# EAGLE design maze_hub_1_1 (EAGLE 6.6.0)
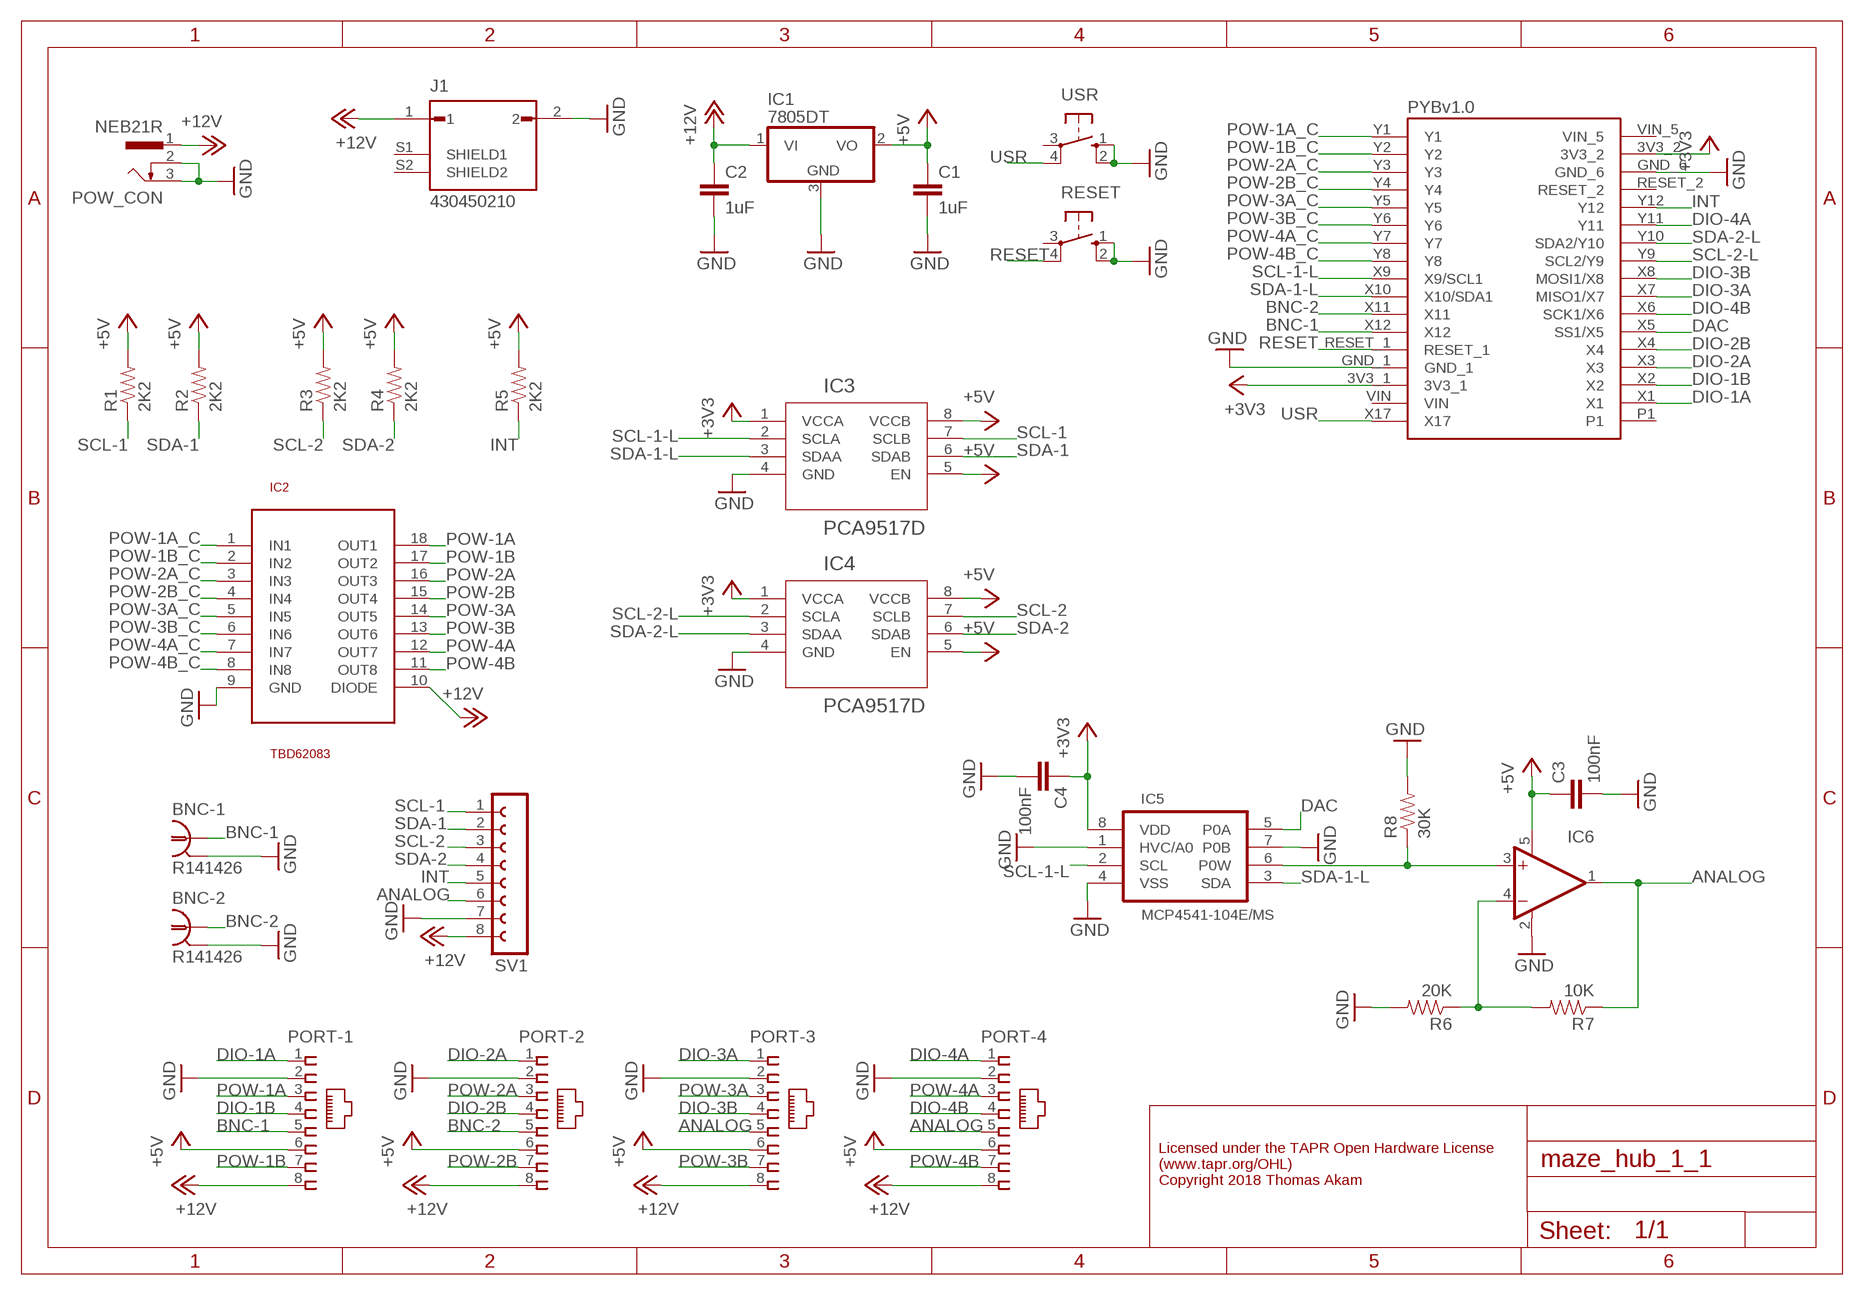
[diagram p0: schematic, sheet 1]

## Parts
BNC-1  R141426  [R141426]
BNC-2  R141426  [R141426]
C1  1uF  C-EUC1206  [C1206]
C2  1uF  C-EUC1206  [C1206]
C3  100nF  C-EUC0805  [C0805]
C4  100nF  C-EUC0805  [C0805]
IC1  7805DT  [TO252]
IC2  TBD62083  ULN2803  [SO18L]
IC3  PCA9517D  [D8]
IC4  PCA9517D  [D8]
IC5  MCP4541-104E/MS  [SOP65P490X110-8N]
IC6  OPA197  [SOT23-5]
J1  430450210  [MOLEX_430450210]
PORT-1  RJ45VERTICAL  [RJ45-NO-SHIELD-VERTICAL]
PORT-2  RJ45VERTICAL  [RJ45-NO-SHIELD-VERTICAL]
PORT-3  RJ45VERTICAL  [RJ45-NO-SHIELD-VERTICAL]
PORT-4  RJ45VERTICAL  [RJ45-NO-SHIELD-VERTICAL]
POW_CON  NEB21R  [NEB21R]
R1  2K2  0.3OHM-1/8W-1%(0805)  [0805]
R2  2K2  0.3OHM-1/8W-1%(0805)  [0805]
R3  2K2  0.3OHM-1/8W-1%(0805)  [0805]
R4  2K2  0.3OHM-1/8W-1%(0805)  [0805]
R5  2K2  0.3OHM-1/8W-1%(0805)  [0805]
R6  20K  0.3OHM-1/8W-1%(0805)  [0805]
R7  10K  0.3OHM-1/8W-1%(0805)  [0805]
R8  30K  0.3OHM-1/8W-1%(0805)  [0805]
RESET  40-XX  [B3F-40XX]
SV1  FE08W  [FE08W]
U$1  PYBOARD-REDUCED  [PYBOARD-REDUCED]
USR  40-XX  [B3F-40XX]

## Nets
+3V3: C4.1 IC3.1(VCCA) IC4.1(VCCA) IC5.8(VDD) U$1.3V3_1 U$1.3V3_2
+5V: C1.1 C3.1 IC1.2(VO) IC3.5(EN) IC3.8(VCCB) IC4.5(EN) IC4.8(VCCB) IC6.5(V+) PORT-1.6 PORT-2.6 PORT-3.6 PORT-4.6 R1.2 R2.2 R3.2 R4.2 R5.2
+12V: C2.1 IC1.1(VI) IC2.10(DIODE) J1.1 PORT-1.8 PORT-2.8 PORT-3.8 PORT-4.8 POW_CON.1 SV1.8
ANALOG: IC6.1(OUT) PORT-3.5 PORT-4.5 R7.1 SV1.6
BNC-1: BNC-1.1 PORT-1.5 U$1.X12
BNC-2: BNC-2.1 PORT-2.5 U$1.X11
DAC: IC5.5(P0A) U$1.X5(SS1/X5)
DIO-1A: PORT-1.1 U$1.X1
DIO-1B: PORT-1.4 U$1.X2
DIO-2A: PORT-2.1 U$1.X3
DIO-2B: PORT-2.4 U$1.X4
DIO-3A: PORT-3.1 U$1.X7(MISO1/X7)
DIO-3B: PORT-3.4 U$1.X8(MOSI1/X8)
DIO-4A: PORT-4.1 U$1.Y11
DIO-4B: PORT-4.4 U$1.X6(SCK1/X6)
GND: BNC-1.2(GND) BNC-2.2(GND) C1.2 C2.2 C3.2 C4.2 IC1.3(GND) IC2.9(GND) IC3.4(GND) IC4.4(GND) IC5.1(HVC/A0) IC5.4(VSS) IC5.7(P0B) IC6.2(V-) J1.2 PORT-1.2 PORT-2.2 PORT-3.2 PORT-4.2 POW_CON.2 POW_CON.3 R6.2 R8.2 RESET.1(S) RESET.2(S1) SV1.7 U$1.GND_1 U$1.GND_6 USR.1(S) USR.2(S1)
INT: R5.1 SV1.5 U$1.Y12
N$6: IC6.4(-IN) R6.1 R7.2
POW-1A: IC2.18(OUT1) PORT-1.3
POW-1A_C: IC2.1(IN1) U$1.Y1
POW-1B: IC2.17(OUT2) PORT-1.7
POW-1B_C: IC2.2(IN2) U$1.Y2
POW-2A: IC2.16(OUT3) PORT-2.3
POW-2A_C: IC2.3(IN3) U$1.Y3
POW-2B: IC2.15(OUT4) PORT-2.7
POW-2B_C: IC2.4(IN4) U$1.Y4
POW-3A: IC2.14(OUT5) PORT-3.3
POW-3A_C: IC2.5(IN5) U$1.Y5
POW-3B: IC2.13(OUT6) PORT-3.7
POW-3B_C: IC2.6(IN6) U$1.Y6
POW-4A: IC2.12(OUT7) PORT-4.3
POW-4A_C: IC2.7(IN7) U$1.Y7
POW-4B: IC2.11(OUT8) PORT-4.7
POW-4B_C: IC2.8(IN8) U$1.Y8
RESET: RESET.4(P1) U$1.RESET_1
SCL-1: IC3.7(SCLB) R1.1 SV1.1
SCL-1-L: IC3.2(SCLA) IC5.2(SCL) U$1.X9(X9/SCL1)
SCL-2: IC4.7(SCLB) R3.1 SV1.3
SCL-2-L: IC4.2(SCLA) U$1.Y9(SCL2/Y9)
SDA-1: IC3.6(SDAB) R2.1 SV1.2
SDA-1-L: IC3.3(SDAA) IC5.3(SDA) U$1.X10(X10/SDA1)
SDA-2: IC4.6(SDAB) R4.1 SV1.4
SDA-2-L: IC4.3(SDAA) U$1.Y10(SDA2/Y10)
SIG3: IC5.6(P0W) IC6.3(+IN) R8.1
USR: U$1.X17 USR.4(P1)
Unconnected: J1.S1(SHIELD1) J1.S2(SHIELD2) RESET.3(P) U$1.P1 U$1.RESET_2 U$1.VIN U$1.VIN_5 USR.3(P)

## Notes on the sheet
- Licensed under the TAPR Open Hardware License
  (www.tapr.org/OHL)
  Copyright 2018 Thomas Akam

## Power pins joined to a net without a drawn wire
GND: BNC-1.3(GND) BNC-1.4(GND) BNC-1.5(GND) BNC-2.3(GND) BNC-2.4(GND) BNC-2.5(GND)

## Library data of the parts
BNC-1 BNC-2 = con-coax:R141426: BNC COAX CONNECTOR Radiall 50/75 Ohm Spoerle; MF: FARNELL; MPN: R141426161; OC_FARNELL: 4195115; OC_NEWARK: 14J7919
C1 C2 = resistor:C-EU: CAPACITOR, European symbol
C3 C4 = rcl:C-EU: CAPACITOR, European symbol
IC1 = linear:78*: Positive VOLTAGE REGULATOR Source: http://cache.national.com/ds/LM/LM78L05.pdf http://www.fairchildsemi.com/ds/LM/LM7805.pdf
IC2 = uln2803:ULN2803
IC3 IC4 = ultra_librarian:PCA9517D; BUILT_BY: EMA_UL_Team; MANUFACTURER_PART_NUMBER: PCA9517D; VENDOR: Texas Instruments
IC5 = Digital_potentiometers:MCP4541-104E/MS
IC6 = burr-brown:OPA197
J1 = Molex_430450210:430450210: Check availability <https://pricing.snapeda.com/parts/43045-0210/Molex/view-part?ref=eda>; AVAILABILITY: In Stock; CHECK_PRICES: https://www.snapeda.com/parts/43045-0210/Molex/view-part/?ref=eda; DESCRIPTION: Microfit 3.0 RA SMT/Nail DR 15Au 2 Ckt | Molex Incorporated 43045-0210; MF: Molex; MP: 43045-0210; PACKAGE: None; PRICE: None; SNAPEDA_LINK: https://www.snapeda.com/parts/43045-0210/Molex/view-part/?ref=snap
PORT-1-PORT-4 = con-tycoelectronics-vertical_RJ45:RJ45: CORCOM Modular RJ Jacks No Shield Source: www.tycoelectronics.com .. ENG_DS_1654001_1099_RJ_L_0507.pdf
POW_CON = con-lumberg:NEB21R: Netzgeräte-Einbaukupplung abgewinkelte Ausführung mit Öffner Source: http://www.lumberg.com/Produkte/PDFs/NEB21R.pdf; MPN: NEB 21 R; OC_FARNELL: 1217037; OC_NEWARK: 97K6458
R1-R8 = SparkFun-Resistors:0.3OHM-1/8W-1%(0805): RES-11622; PROD_ID: RES-11622; VALUE: 0.3
RESET USR = switch-omron:40-XX: OMRON SWITCH; MF: OMRON COMPONENTS USA; MPN: B3F-4000; OC_FARNELL: 176434; OC_NEWARK: 36K3105
SV1 = con-lsta:FE08W: FEMALE HEADER; OC_FARNELL: unknown; OC_NEWARK: unknown
U$1 = micropython:PYBOARD-REDUCED

## Board
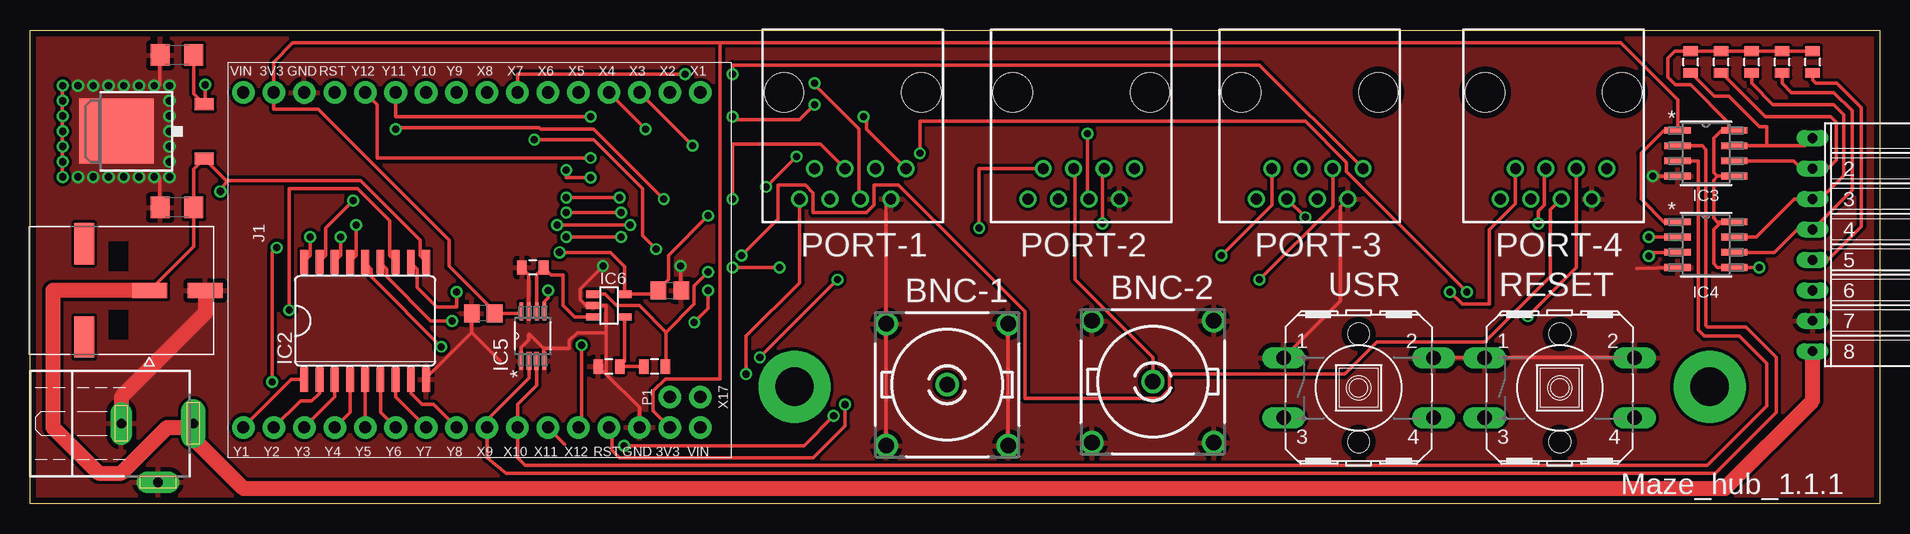
[diagram p1: board, top side]
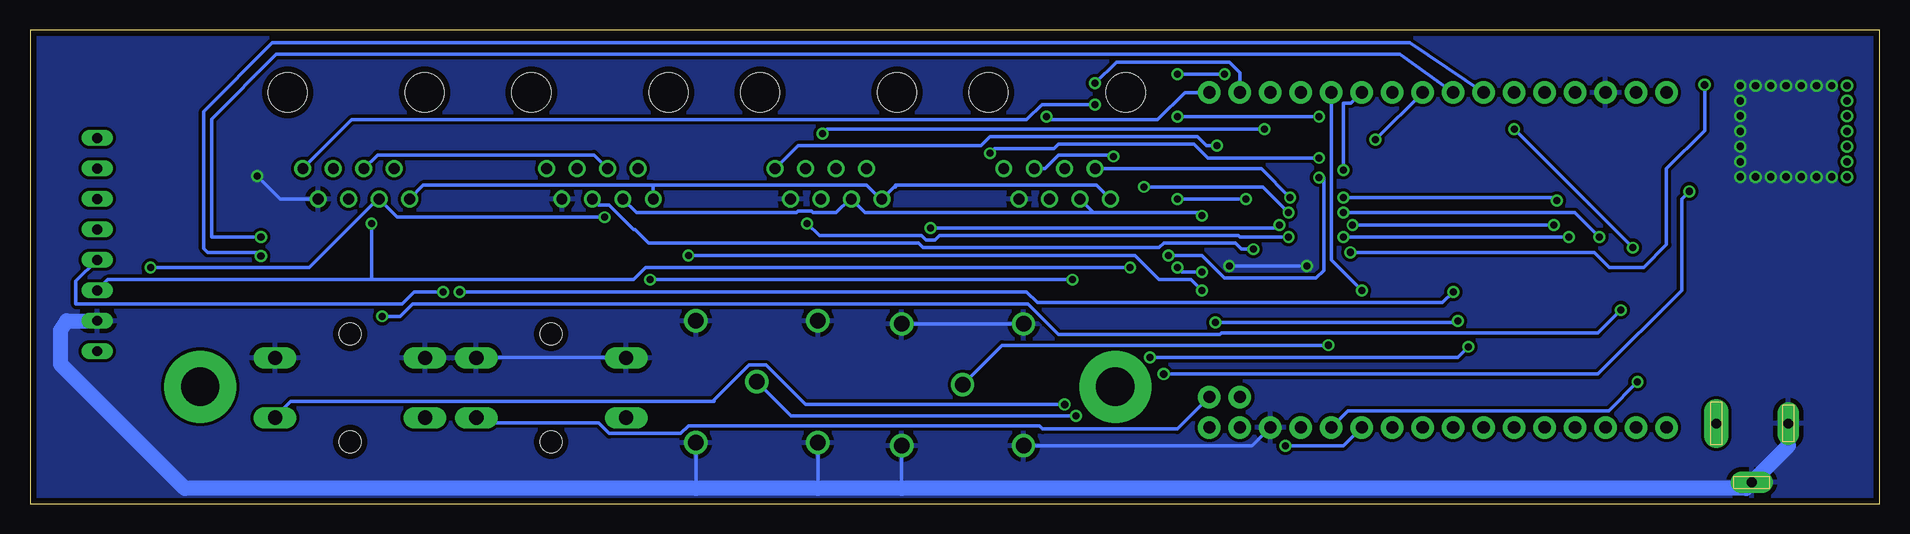
[diagram p2: board, bottom side, seen from below]

Size 154.19 x 39.5 mm. Coordinates in mm from the lower left corner, seen from the top.
Outline: 0,0 0,39.5 154.19,39.5 154.19,0 0,0
Copper layers (1*16): Top 0.035mm / dielectric 1.5mm / Bottom 0.035mm
Design rules "default *": minimum track width 12mil, minimum drill 23mil, track to track 10mil, track to pad 10mil, pad to pad 10mil, via to via 10mil, smd to smd 10mil, copper to edge 20mil, drill to drill 8mil, minimum pad ring 10mil, minimum via ring 8mil, stop-mask expansion 4mil, vias tented up to drill 0mil, thermal gap 15mil
vRestrict: area 22.1,11.7 to 33.8,19.1; area 46.5,10.7 to 54.9,19.3; area 64,20.1 to 74.9,23.1; area 72.6,16 to 81,18.8; area 82.5,20.3 to 94,22.9; area 90.2,16.5 to 99.1,19.1; area 101.6,20.3 to 113,22.9; area 108,16.5 to 114.3,20.3; area 121.9,16.5 to 133.3,22.9; area 135.9,16.5 to 143.5,31.8; area 69.6,3 to 84.1,16.8; area 86.9,3 to 100.6,16.5

### Footprints (pad centres in the part's own frame; a part is rotated, then mirrored left to right if it is on the bottom)
R141426 = drill 1.295: 1 0,0; 2 5.08,5.08; 3 -5.08,5.08; 4 -5.08,-5.08; 5 5.08,-5.08
C1206 = smd 1.6 x 1.8: 1 -1.4,0; 2 1.4,0
C0805 = smd 1.3 x 1.5: 1 -0.95,0; 2 0.95,0
TO252 = smd 1 x 1.6: 1 -2.28,-4.8; 2 2.28,-4.8 | smd 5.4 x 6.2: 3 0,2.5
SO18L = smd 0.66 x 2.032: 1 -5.08,-4.902; 2 -3.81,-4.902; 3 -2.54,-4.902; 4 -1.27,-4.902; 5 0,-4.902; 6 1.27,-4.902; 7 2.54,-4.902; 8 3.81,-4.902; 9 5.08,-4.902; 10 5.08,4.902; 11 3.81,4.902; 12 2.54,4.902; 13 1.27,4.902; 14 0,4.902; 15 -1.27,4.902; 16 -2.54,4.902; 17 -3.81,4.902; 18 -5.08,4.902
D8 = smd 2.184 x 0.559: 1 -2.362,1.905; 2 -2.362,0.635; 3 -2.362,-0.635; 4 -2.362,-1.905; 5 2.362,-1.905; 6 2.362,-0.635; 7 2.362,0.635; 8 2.362,1.905
SOP65P490X110-8N = smd 1.499 x 0.305: 1 -2.057,0.965; 4 -2.057,-0.965; 5 2.057,-0.965; 6 2.057,-0.33; 7 2.057,0.33; 8 2.057,0.965 | smd 1.499 x 0.406: 2 -2.057,0.305 | smd 1.499 x 0.356: 3 -2.057,-0.305
SOT23-5 = smd 0.6 x 1.2: 1 -0.95,-1.306; 2 0,-1.306; 3 0.95,-1.306; 4 0.95,1.306; 5 -0.95,1.306
MOLEX_430450210 = smd 1.27 x 2.92: 1 0,2.37; 2 0,7 | smd 3.43 x 1.65: S1 3.885,-3.1; S2 -3.885,-3.1
RJ45-NO-SHIELD-VERTICAL = drill 0.9 pad 1.4: 1 -4.445,5.08; 2 -3.175,7.62; 3 -1.905,5.08; 4 -0.635,7.62; 5 0.635,5.08; 6 1.905,7.62; 7 3.175,5.08; 8 4.445,7.62 | hole 3.251: -5.715,-1.27; 5.715,-1.27
NEB21R = drill 0.813 pad 2.032 long: 1 0,7.35 | drill 0.813 pad 1.778 long: 2 4.9,4.4; 3 0,1.35
0805 = smd 0.8 x 1.2: 1 -0.9,0; 2 0.9,0
B3F-40XX = drill 1.194 long: 1 -6.248,2.489; 2 6.248,2.489; 3 -6.248,-2.489; 4 6.248,-2.489 | hole 1.803: 0,-4.496; 0,4.496
FE08W = drill 0.813 long: 1 -8.89,0; 2 -6.35,0; 3 -3.81,0; 4 -1.27,0; 5 1.27,0; 6 3.81,0; 7 6.35,0; 8 8.89,0
PYBOARD-REDUCED = drill 1.016 pad 1.88: 3V3_1 2.54,5.08; 3V3_2 30.48,38.1; GND_1 2.54,7.62; GND_6 30.48,35.56; P1 5.08,5.08; RESET_1 2.54,10.16; RESET_2 30.48,33.02; VIN 2.54,2.54; VIN_5 30.48,40.64; X1 30.48,2.54; X2 30.48,5.08; X3 30.48,7.62; X4 30.48,10.16; X5 30.48,12.7; X6 30.48,15.24; X7 30.48,17.78; X8 30.48,20.32; X9 2.54,20.32; X10 2.54,17.78; X11 2.54,15.24; X12 2.54,12.7; X17 5.08,2.54; Y1 2.54,40.64; Y2 2.54,38.1; Y3 2.54,35.56; Y4 2.54,33.02; Y5 2.54,30.48; Y6 2.54,27.94; Y7 2.54,25.4; Y8 2.54,22.86; Y9 30.48,22.86; Y10 30.48,25.4; Y11 30.48,27.94; Y12 30.48,30.48

### Placement (x,y rotation side)
BNC-1  76.45,9.91 0 top
BNC-2  93.6,10.16 0 top
C1  12.26,37.4 180 top
C2  12.26,24.7 180 top
C3  53.34,17.78 0 top
C4  37.78,15.88 180 top
IC1  9.72,31.05 90 top
IC2  27.94,15.24 0 top
IC3  139.7,29.21 0 top
IC4  139.7,21.59 0 top
IC5  41.91,13.97 90 top
IC6  48.26,16.51 270 top
J1  7.62,17.78 270 top
PORT-1  68.58,33.02 180 top
PORT-2  87.63,33.02 180 top
PORT-3  106.68,33.02 180 top
PORT-4  127,33.02 180 top
POW_CON  6.27,6.67 270 top
R1  138.43,36.83 90 top
R2  140.97,36.83 90 top
R3  143.51,36.83 90 top
R4  146.05,36.83 90 top
R5  148.59,36.83 90 top
R6  48.26,11.43 180 top
R7  52.07,11.43 180 top
R8  41.91,19.68 180 top
RESET  127.51,9.65 0 top
SV1  148.59,21.59 270 top
U$1  58.42,3.81 90 top
USR  110.74,9.65 0 top

### Tracks (layer width: path | path; a pad name or v marks a point on that pad's centre or on a via)
+3V3
  Top 0.305: 57.53,38.42 132.59,38.42 137.34,33.67 IC3.1 136.21,31.11 134.3,29.21 134.3,25.4 136.21,23.5 IC4.1 | 57.53,38.42 21.91,38.42 20.32,36.83 U$1.3V3_2 20.32,32.89 24,32.89 34.92,21.97 34.92,19.81 38.73,16 C4.1 40.79,15.88 IC5.8 | U$1.3V3_1 51.94,7.75 51.94,9.4 52.96,10.41 57.53,10.41 57.53,38.42
+5V  (via drill 0.58, 0.6)
  Top 0.305: R1.2 R2.2 | R2.2 R3.2 R4.2 R5.2 | 141.6,31.11 140.97,31.11 140.34,30.48 140.34,27.62 140.65,27.3 | 140.65,27.3 IC3.5 | 140.65,27.3 140.34,26.99 140.34,23.81 140.65,23.5 IC4.8 140.97,23.5 140.34,22.86 140.34,20 140.65,19.68 IC4.5 v144.15,19.68 | R2.2 137.11,37.73 136.53,37.15 136.53,35.56 137.16,34.92 138.43,34.92 141.6,31.75 141.6,31.11 | 141.6,31.11 IC3.8 | PORT-3.6 v106.3,23.88 | v56.52,24 53.21,20.7 53.21,18.67 52.45,17.91 C3.1 52.07,17.46 IC6.5 49.57,19.78 48.39,20.95 v44.13,20.95 | C1.1 13.65,34.19 IC1.2 14.61,33.42 v14.61,34.92
  Bottom 0.305: PORT-3.6 103.63,24.26 90.3,24.26 90.17,24.38 89.03,24.38 88.9,24.26 87,24.26 85.85,25.4 PORT-2.6 84.58,24.26 65.53,24.26 | v106.3,23.88 123.57,23.88 PORT-4.6 125.22,25.4 130.94,19.68 v144.15,19.68 | v56.52,24 56.77,24.26 65.53,24.26 | PORT-1.6 65.53,24.26 | v14.61,34.92 14.61,31.11 17.78,27.94 17.78,21.59 19.68,19.68 22.54,19.68 23.81,20.95 v44.13,20.95
+12V  (via drill 0.6)
  Top 0.305: IC2.10 33.02,20.19 32.51,20.7 32.51,21.97 27.56,26.92 16.51,26.92 | 16.51,26.92 16.36,26.92 IC1.1 13.65,27.91 C2.1 13.65,21.45 J1.1 | PORT-1.8 64.14,18.41 59.69,13.97 v59.69,10.79 | v15.88,26.04 15.88,26.29 16.51,26.92
  Top 1.27: SV1.8 148.59,8.57 141.29,1.27 17.78,1.27 13.97,5.08 13.97,6.32 POW_CON.1 13.3,6.35 11.43,6.35 7.62,2.54 5.71,2.54 1.91,6.35 1.91,17.78 J1.1
  Bottom 0.305: PORT-1.8 65.28,26.54 82.04,26.54 82.04,26.42 82.17,26.42 PORT-2.8 83.31,25.4 84.45,26.54 102.23,26.54 | PORT-4.8 121.41,26.54 102.23,26.54 | 102.23,26.54 PORT-3.8 | v59.69,10.79 23.5,10.79 16.51,17.78 16.51,25.4 v15.88,26.04
ANALOG  (via drill 0.58)
  Top 0.305: IC6.1 47.94,17.46 48.9,16.51 50.8,16.51 53.02,14.29 | 53.02,14.29 53.02,11.48 R7.1 | v58.55,19.68 v62.48,19.68 | v56.52,19.3 55.37,18.16 55.37,16.64 53.02,14.29 | PORT-4.5 126.24,27.81 126.24,24.89 125.73,24.38 v125.73,23.37
  Bottom 0.305: SV1.6 147.7,18.67 125.73,18.67 | 125.73,18.67 103.89,18.67 102.87,19.68 v62.48,19.68 | v58.55,19.68 58.17,19.3 v56.52,19.3 | PORT-3.5 107.19,29.08 125.22,29.08 PORT-4.5 | 125.73,18.67 v125.73,23.37
BNC-1  (via drill 0.58)
  Top 0.305: U$1.X12 45.97,6.6 v45.97,13.21 | PORT-1.5 65.91,29.97 58.55,29.97 v58.55,25.4 | v52.83,25.4 46.99,31.24 42.55,31.24 42.42,31.37 30.48,31.37 v30.48,31.24 | v20.57,21.34 20.19,20.95 v20.19,10.16
  Bottom 0.305: v45.97,13.21 73.15,13.21 BNC-1.1 | v52.83,25.4 v58.55,25.4 | v20.57,21.34 v30.48,31.24 | v20.19,10.16 22.61,7.75 44.32,7.75 U$1.X12
BNC-2  (via drill 0.58, 0.6)
  Top 0.305: 44.58,4.95 U$1.X11 | PORT-2.5 87.12,27.81 87.12,18.67 93.6,12.19 BNC-2.1 | v49.53,4.83 64.52,4.83 v66.99,7.3
  Bottom 0.305: U$1.X11 44.7,4.83 v49.53,4.83 | BNC-2.1 90.74,7.3 v66.99,7.3
DAC  (via drill 0.6)
  Top 0.305: v43.18,17.78 43.18,17.14 42.86,16.83 42.86,16.04 IC5.5
  Bottom 0.305: U$1.X5 45.72,20.32 v43.18,17.78
DIO-1A  (via drill 0.58)
  Top 0.305: PORT-1.1 69.72,31.24 69.72,32 v69.47,32.26
  Bottom 0.305: v69.47,32.26 69.22,32 60.2,32 57.91,34.29 U$1.X1
DIO-1B  (via drill 0.58)
  Top 0.305: PORT-1.4 69.09,25.53 69.09,31.24 65.41,34.92 v65.41,35.05
  Bottom 0.305: v65.41,35.05 63.63,36.83 54.23,36.83 53.34,35.94 U$1.X2
DIO-2A  (via drill 0.58)
  Top 0.305: U$1.X3 v55.24,29.84
  Bottom 0.305: v55.24,29.84 56.13,29.84 56.9,30.61 74.17,30.61 74.93,29.84 90.17,29.84 PORT-2.1
DIO-2B  (via drill 0.58)
  Top 0.305: U$1.X4 v51.31,31.24 | PORT-2.4 88.14,25.53 v88.14,30.86
  Bottom 0.305: v88.14,30.86 87.76,31.24 v51.31,31.24
DIO-3A  (via drill 0.58)
  Top 0.305: PORT-3.1 102.49,36.58 58.55,36.58 v58.55,35.81 | v54.61,35.81 40.64,35.81 U$1.X7
  Bottom 0.305: v54.61,35.81 v58.55,35.81
DIO-3B  (via drill 0.58)
  Top 0.305: v52.2,21.21 51.05,22.35 51.05,26.29 46.99,30.35 v42.04,30.35
  Bottom 0.305: PORT-3.4 106.81,24.89 105.92,24.89 103.89,22.86 103.76,22.86 102.62,21.72 80.14,21.72 79.76,21.34 60.07,21.34 59.69,21.72 53.72,21.72 53.21,21.21 v52.2,21.21 | U$1.X8 v42.04,30.35
DIO-4A  (via drill 0.58)
  Top 0.305: v65.41,33.27 64.14,32 58.55,32 v58.55,32.26 | v46.74,32.26 30.48,32.26 U$1.Y11
  Bottom 0.305: PORT-4.1 127.38,32 71.12,32 69.85,33.27 v65.41,33.27 | v46.74,32.26 v58.55,32.26
DIO-4B  (via drill 0.58)
  Top 0.305: PORT-4.4 126.75,24.51 126.75,18.92 121.28,13.46 112.27,13.46 109.6,10.79 95,10.79 95,9.53 94.23,8.76 82.93,8.76 82.93,16 72.39,26.54 70.36,26.54 70.36,24.89 69.72,24.26 65.28,24.26 65.28,25.91 64.64,26.54 62.36,26.54 62.36,23.75 v59.31,20.7 | v46.74,27.18 44.7,27.18 v44.7,27.81
  Bottom 0.305: v59.31,20.7 56.52,20.7 54.61,18.8 46.99,18.8 46.35,19.43 46.35,27.18 v46.74,27.18 | v44.7,27.81 44.7,33.4 44.07,33.4 U$1.X6
GND  (via drill 0.58, 0.61)
  Top 0.305: 40.96,11.93 40.96,13.02 41.58,13.64 41.58,14.1 41.66,14.1 42.8,12.95 | 39.2,11.91 36.83,14.29 | 36.83,14.29 C4.2 | IC2.9 33.02,10.48 36.83,14.29 | 42.8,12.95 42.8,11.94 | 47.94,10.86 50.8,8 U$1.GND_1 | 47.94,10.86 47.37,11.43 R6.2 | 48.01,14.22 48.01,10.92 47.94,10.86 | 48.01,14.22 48.01,16.51 IC6.2 46.35,16.51 45.85,17.02 45.85,17.91 v47.75,19.81 | v54.23,19.81 54.23,17.78 C3.2 | 42.8,12.95 44.96,12.95 44.96,13.59 45.59,14.22 48.01,14.22 | PORT-1.2 71.37,25.02 BNC-1.3 BNC-1.4 | 133.92,19.62 137.29,19.68 IC4.4 | 133.86,12.19 RESET.2 | USR.2 117.09,12.19 121.16,12.19 RESET.1 121.28,12.19 133.73,12.19 | PORT-3.2 109.22,24.77 109.22,16.89 104.52,12.19 USR.1 | C2.2 10.79,24.77 10.79,27.18 v10.35,27.24 | v10.35,34.86 10.79,34.92 10.79,37.21 C1.2 | BNC-1.5 BNC-1.2 | v135.25,27.3 IC3.4 | IC5.7 41.58,19.11 R8.2
  Top 1.27: J1.2 14.62,15.89 7.62,8.89 POW_CON.3
  Bottom 0.305: v47.75,19.81 v54.23,19.81 | U$1.GND_1 52.32,4.83 BNC-1.4 | 81.79,15.24 BNC-1.2 BNC-1.3 | 104.39,12.19 USR.1 104.52,12.19 116.97,12.19 USR.2 | 4.06,27.18 v4,27.24 | 81.53,1.27 BNC-1.5 | 88.52,1.27 BNC-2.4 | 98.68,1.27 BNC-2.5 | v135.25,27.3 133.35,25.4 PORT-4.2
  Bottom 1.27: SV1.7 151.13,15.24 151.64,14.48 151.64,11.62 141.29,1.27 98.68,1.27 88.52,1.27 81.53,1.27 11.17,1.27 POW_CON.2 7.62,4.82 POW_CON.3
  other vias: 5.27,27.24 7.81,27.24 11.62,28.51 9.08,34.86 6.54,27.24 9.08,27.24 11.62,27.24 11.62,31.05 7.81,34.86 11.62,34.86 6.54,34.86 5.27,34.86 11.62,32.32 11.62,29.78 11.62,33.59 4,34.86
  pour Top: 0,0 0,39.37 154.69,39.12 154.69,-0.25
  pour Bottom: 0,0 0,39.37 154.69,39.37 154.69,0
  pour Top (no thermals): 11.62,27.24 2.41,27.24 2.41,34.86 11.62,34.86
GND1  (via drill 0.61)
  Top 0.305: v2.73,34.86 2.67,34.8 2.67,33.66 v2.73,33.59 2.67,33.53 2.67,32.38 v2.73,32.32 2.67,32.26 2.67,31.11 v2.73,31.05 2.67,30.99 2.67,29.84 v2.73,29.78 2.67,29.72 2.67,28.57 v2.73,28.51 2.67,28.45 2.67,27.3 v2.73,27.24
INT  (via drill 0.58)
  Top 0.305: v119.76,17.65 109.73,27.69 109.73,28.45 106.3,31.88 74.17,31.88 v74.17,29.21 | v46.74,28.83 28.96,28.83 28.96,33.27 U$1.Y12 | R5.1 148.59,35.31 148.84,35.05 150.62,35.05 152.65,33.02 152.65,23.11 149.86,20.32 SV1.5
  Bottom 0.305: SV1.5 150.37,18.54 150.37,16.64 123.19,16.64 122.17,17.65 v119.76,17.65 | v74.17,29.21 73.79,29.59 68.83,29.59 68.45,29.97 57.15,29.97 56.01,28.83 v46.74,28.83
N$3  (via drill 3.2 pad 6)
  other vias: 140,9.75
N$4  (via drill 3.2 pad 6)
  other vias: 63.73,9.75
N$6
  Top 0.305: IC6.4 49.57,11.84 R6.1 R7.2
POW-1A  (via drill 0.58)
  Top 0.305: v23.37,22.23 23.37,20.7 22.86,20.19 IC2.18 | v49.28,24.26 v44.7,24.26 | v63.88,28.96 v61.34,26.42
  Bottom 0.305: v23.37,22.23 25.4,24.26 v44.7,24.26 | v49.28,24.26 51.44,26.42 v61.34,26.42 | v63.88,28.96 64.01,29.08 68.45,29.08 69.6,27.94 PORT-1.3
POW-1A_C
  Top 0.305: IC2.1 21.77,10.34 U$1.Y1
POW-1B  (via drill 0.58)
  Top 0.305: v26.92,25.27 24.64,22.99 24.64,20.7 24.13,20.19 IC2.17 | v49.15,25.53 v44.7,25.53
  Bottom 0.305: v26.92,25.27 27.18,25.53 v44.7,25.53 | v49.15,25.53 51.56,27.94 PORT-1.7
POW-1B_C
  Top 0.305: IC2.2 24.13,9.21 23.5,8.57 22.54,8.57 U$1.Y2
POW-2A  (via drill 0.58)
  Top 0.305: v25.91,22.23 25.91,20.7 25.4,20.19 IC2.16 | v49.28,22.23 v44.7,22.23 | PORT-2.3 89.41,27.81 v89.41,23.37
  Bottom 0.305: v44.7,22.23 v25.91,22.23 | v49.28,22.23 53.34,22.23 53.47,22.35 78.36,22.35 78.74,21.97 79.5,21.97 79.88,22.35 88.39,22.35 v89.41,23.37
POW-2A_C
  Top 0.305: IC2.3 25.4,8.89 U$1.Y3
POW-2B  (via drill 0.58)
  Top 0.305: v27.18,23.24 27.18,20.7 26.67,20.19 IC2.15 | v50.04,23.24 v43.94,23.24 | PORT-2.7 79.12,27.94 v79.12,22.99
  Bottom 0.305: v43.94,23.24 v27.18,23.24 | v50.04,23.24 50.29,22.99 v79.12,22.99
POW-2B_C
  Top 0.305: IC2.4 26.67,7.62 U$1.Y4
POW-3A  (via drill 0.58)
  Top 0.305: v34.29,13.08 28.45,18.92 28.45,19.56 27.94,20.07 IC2.14 | v67.31,18.67 v60.83,12.19 | v102.49,18.67 108.58,24.77 PORT-3.3
  Bottom 0.305: v34.29,13.08 35.18,12.19 v60.83,12.19 | v102.49,18.67 v67.31,18.67
POW-3A_C
  Top 0.305: IC2.5 U$1.Y5
POW-3B  (via drill 0.58)
  Top 0.305: v35.18,15.24 33.4,15.24 29.72,18.92 29.72,19.56 29.21,20.07 IC2.13 | v55.37,15.11 56.52,16.26 v56.52,17.78 | PORT-3.7 103.5,24.89 v99.31,20.7
  Bottom 0.305: v35.18,15.24 35.31,15.11 v55.37,15.11 | v56.52,17.78 57.4,18.67 60.07,18.67 62.1,20.7 v99.31,20.7
POW-3B_C
  Top 0.305: IC2.6 29.21,7.62 U$1.Y6
POW-4A  (via drill 0.58)
  Top 0.305: v21.59,16.13 21.59,26.29 27.3,26.29 29.97,23.62 29.97,20.7 30.48,20.19 IC2.12 | v124.84,15.62 128.91,19.68 PORT-4.3
  Bottom 0.305: v124.84,15.62 123.32,15.62 122.3,16.64 70.99,16.64 68.45,14.1 54.99,14.1 54.86,14.22 23.5,14.22 v21.59,16.13
POW-4A_C
  Top 0.305: IC2.7 30.48,8.89 U$1.Y7
POW-4B  (via drill 0.58)
  Top 0.305: v35.56,17.65 35.56,16.38 33.91,16.38 32.26,18.03 32.26,19.56 31.75,20.07 IC2.11 | v118.36,17.65 119.38,16.64 121.67,16.64 121.67,22.86 123.83,25.02 PORT-4.7
  Bottom 0.305: v35.56,17.65 36.45,16.76 70.23,16.76 71.12,17.65 v118.36,17.65
POW-4B_C
  Top 0.305: IC2.8 31.75,9.21 32.7,8.26 33.66,8.26 U$1.Y8
RESET  (via drill 0.6)
  Top 0.305: U$1.RESET_1 48.51,6.1 48.51,4.45 49.15,3.81 65.28,3.81 67.94,6.48 v67.94,8.26
  Bottom 0.305: RESET.4 133.73,7.24 132.46,8.51 97.16,8.51 97.16,8.64 94.23,11.56 92.84,11.56 89.53,8.26 v67.94,8.26
SCL-1
  Top 0.305: IC3.7 144.78,29.84 | 144.78,29.84 147.96,29.84 SV1.1 | 144.78,29.84 144.78,31.43 144.15,31.43 141.6,33.97 140.39,33.97 R1.1
SCL-1-L
  Top 0.305: IC3.2 139.38,29.84 139.7,29.53 139.7,14.86 139.83,14.73 143,14.73 145.54,12.19 145.54,7.62 140.46,2.54 39.69,2.54 38.1,3.81 U$1.X9 38.1,6.99 41.59,10.48 41.59,11.9 IC5.2
SCL-2
  Top 0.305: IC4.7 143.89,22.23 147.07,25.4 SV1.3 149.22,25.4 151.19,27.37 151.19,32.45 150.37,33.27 145.29,33.27 143.51,35.05 R3.1
SCL-2-L  (via drill 0.6)
  Top 0.305: IC4.2 v134.94,22.23
  Bottom 0.305: v134.94,22.23 139.06,22.23 139.06,32.07 133.67,37.47 40.01,37.47 U$1.Y9
SDA-1
  Top 0.305: IC3.6 147,28.57 147.64,27.94 SV1.2 149.86,27.94 150.56,28.64 150.56,31.81 150.11,32.26 144.64,32.26 R2.1
SDA-1-L
  Top 0.305: IC3.3 139.06,28.57 139.06,14.48 139.57,13.97 142.49,13.97 144.78,11.68 144.78,8.13 139.83,3.17 41.27,3.17 40.64,3.81 U$1.X10 40.64,8.26 42.23,9.84 42.23,11.9 IC5.3
SDA-2
  Top 0.305: IC4.6 145.41,20.95 147.32,22.86 SV1.4 151.89,26.16 151.89,32.77 150.37,34.29 146.81,34.29 146.05,35.05 R4.1
SDA-2-L  (via drill 0.6)
  Top 0.305: IC4.3 135.25,20.95 v134.94,20.64
  Bottom 0.305: v134.94,20.64 135.25,20.95 139.38,20.95 139.7,21.27 139.7,32.7 133.99,38.42 39.18,38.42 U$1.Y10
SIG3
  Top 0.305: IC6.3 45.4,15.56 44.45,16.51 44.45,19.05 43.45,19.05 R8.1 42.24,19.11 IC5.6
USR
  Bottom 0.305: U$1.X17 58.55,6.22 69.79,6.22 70.04,6.48 99.31,6.48 99.95,5.84 105.92,5.84 106.81,6.73 116.59,6.73 116.97,7.11 USR.4

### Text on the board
tNames: Maze_hub_1.1.1
Document: Licensed under the TAPR Open Hardware License / (www.tapr.org/OHL) / Copyright 2018-2025 Thomas Akam